# Altium project PCB_LDB-U01.PRJPCB (part 2 of 2)
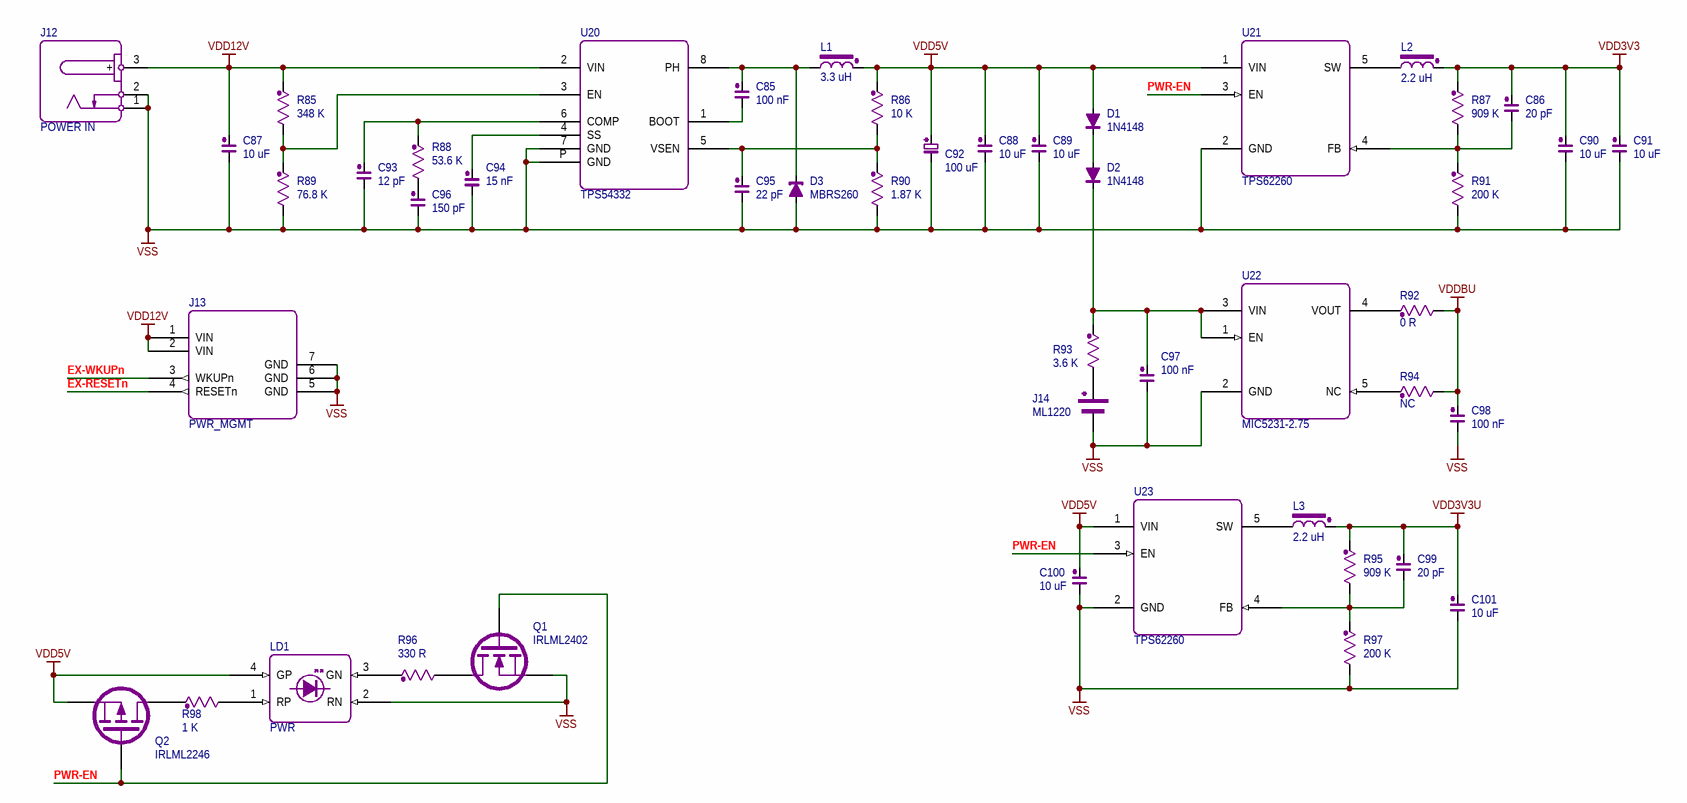
[diagram p9: 09_POWER.SchDoc]

## Nets that join several sheets
VDD3V3: 02_IO_PORTS (18 pins), 03_SHIELD_SLOT_A (8 pins), 04_SHIELD_SLOT_B (8 pins), 05_USB_PORTS (R31.2), 06_ETHERNET (20 pins), 08_JTAG_DEBUG (5 pins), 09_POWER (5 pins)
VDD3V3U: 05_USB_PORTS (13 pins), 08_JTAG_DEBUG (20 pins), 09_POWER (C99.2 C101.2 L3.2 R95.2)
VDD5V: 02_IO_PORTS (7 pins), 05_USB_PORTS (5 pins), 07_AC97_AUDIO (C65.2 U16.1), 08_JTAG_DEBUG (J1.1 J1.3 J1.5 J1.7), 09_POWER (11 pins)
VDD5V-LPA: 02_IO_PORTS (U1.5), 03_SHIELD_SLOT_A (C2.2 J4.35 J4.36)
VDD5V-LPB: 02_IO_PORTS (U1.8), 04_SHIELD_SLOT_B (C11.2 J5.35 J5.36)
VDDBU: 08_JTAG_DEBUG (J1.2 J1.4), 09_POWER (C98.2 R92.1 R94.1)
VSS: 01_Structure (6 pins), 02_IO_PORTS (26 pins), 03_SHIELD_SLOT_A (21 pins), 04_SHIELD_SLOT_B (21 pins), 05_USB_PORTS (30 pins), 06_ETHERNET (19 pins), 07_AC97_AUDIO (17 pins), 08_JTAG_DEBUG (69 pins), 09_POWER (32 pins)
AC97-MCLK: 02_IO_PORTS (J1.138), 07_AC97_AUDIO (R65.1 U15.2)
AC97-RSTn: 02_IO_PORTS (J1.25), 07_AC97_AUDIO (U15.11)
AC97-SCLK: 02_IO_PORTS (J1.131), 07_AC97_AUDIO (U15.6)
AC97-SDI: 02_IO_PORTS (J1.145), 07_AC97_AUDIO (U15.8)
AC97-SDO: 02_IO_PORTS (J1.129), 07_AC97_AUDIO (U15.5)
AC97-SFS: 02_IO_PORTS (J1.147), 07_AC97_AUDIO (U15.10)
EX-RESETn: 08_JTAG_DEBUG (J1.13 J11.3 R78.1 SW1.2), 09_POWER (J13.4)
EX-WKUPn: 08_JTAG_DEBUG (J1.11 SW2.2), 09_POWER (J13.3)
FT-URXD: 02_IO_PORTS (R4.2), 08_JTAG_DEBUG (U17.39)
FT-UTXD: 02_IO_PORTS (R1.2), 08_JTAG_DEBUG (U17.38)
IN-DET: 02_IO_PORTS (J1.197), 07_AC97_AUDIO (J10.5 R71.1)
IN-OPT: 02_IO_PORTS (J1.199), 07_AC97_AUDIO (J10.1 R70.1)
LOP-OE-AH: 02_IO_PORTS (J1.98), 03_SHIELD_SLOT_A (U4.10 U5.10)
LOP-OE-AL: 02_IO_PORTS (J1.99), 03_SHIELD_SLOT_A (U2.10 U3.10)
LOP-OE-BH: 02_IO_PORTS (J1.188), 04_SHIELD_SLOT_B (U8.10 U9.10)
LOP-OE-BL: 02_IO_PORTS (J1.177), 04_SHIELD_SLOT_B (U6.10 U7.10)
LOPA-I2CSCL: 02_IO_PORTS (J1.86), 03_SHIELD_SLOT_A (U5.9)
LOPA-I2CSDA: 02_IO_PORTS (J1.88), 03_SHIELD_SLOT_A (U5.8)
LOPA-IO0: 02_IO_PORTS (J1.91), 03_SHIELD_SLOT_A (U2.6)
LOPA-IO1: 02_IO_PORTS (J1.89), 03_SHIELD_SLOT_A (U2.5)
LOPA-IO2: 02_IO_PORTS (J1.87), 03_SHIELD_SLOT_A (U2.4)
LOPA-IO3: 02_IO_PORTS (J1.83), 03_SHIELD_SLOT_A (U2.1)
LOPA-IO4: 02_IO_PORTS (J1.85), 03_SHIELD_SLOT_A (U2.3)
LOPA-IO5: 02_IO_PORTS (J1.93), 03_SHIELD_SLOT_A (U2.7)
LOPA-IO6: 02_IO_PORTS (J1.95), 03_SHIELD_SLOT_A (U2.8)
LOPA-IO7: 02_IO_PORTS (J1.97), 03_SHIELD_SLOT_A (U2.9)
LOPA-IO8: 02_IO_PORTS (J1.103), 03_SHIELD_SLOT_A (U3.1)
LOPA-IO9: 02_IO_PORTS (J1.105), 03_SHIELD_SLOT_A (U3.3)
LOPA-IO10: 02_IO_PORTS (J1.107), 03_SHIELD_SLOT_A (U3.4)
LOPA-IO11: 02_IO_PORTS (J1.109), 03_SHIELD_SLOT_A (U3.5)
LOPA-IO12: 02_IO_PORTS (J1.111), 03_SHIELD_SLOT_A (U3.6)
LOPA-IO13: 02_IO_PORTS (J1.113), 03_SHIELD_SLOT_A (U3.7)
LOPA-IO14: 02_IO_PORTS (J1.114), 03_SHIELD_SLOT_A (U4.1)
LOPA-IO15: 02_IO_PORTS (J1.112), 03_SHIELD_SLOT_A (U4.3)
LOPA-IO16: 02_IO_PORTS (J1.110), 03_SHIELD_SLOT_A (U4.4)
LOPA-IO17: 02_IO_PORTS (J1.108), 03_SHIELD_SLOT_A (U4.5)
LOPA-IO18: 02_IO_PORTS (J1.106), 03_SHIELD_SLOT_A (U4.6)
LOPA-IO19: 02_IO_PORTS (J1.104), 03_SHIELD_SLOT_A (U4.7)
LOPA-IO20: 02_IO_PORTS (J1.102), 03_SHIELD_SLOT_A (U4.8)
LOPA-IO21: 02_IO_PORTS (J1.100), 03_SHIELD_SLOT_A (U4.9)
LOPA-IO22: 02_IO_PORTS (J1.96), 03_SHIELD_SLOT_A (U5.4)
LOPA-IO23: 02_IO_PORTS (J1.94), 03_SHIELD_SLOT_A (U5.5)
LOPA-IO24: 02_IO_PORTS (J1.92), 03_SHIELD_SLOT_A (U5.6)
LOPA-IO25: 02_IO_PORTS (J1.90), 03_SHIELD_SLOT_A (U5.7)
LOPB-I2CSCL: 02_IO_PORTS (J1.170), 04_SHIELD_SLOT_B (U9.7)
LOPB-I2CSDA: 02_IO_PORTS (J1.172), 04_SHIELD_SLOT_B (U9.6)
LOPB-IO0: 02_IO_PORTS (J1.163), 04_SHIELD_SLOT_B (U6.4)
LOPB-IO1: 02_IO_PORTS (J1.165), 04_SHIELD_SLOT_B (U6.5)
LOPB-IO2: 02_IO_PORTS (J1.167), 04_SHIELD_SLOT_B (U6.6)
LOPB-IO3: 02_IO_PORTS (J1.169), 04_SHIELD_SLOT_B (U6.7)
LOPB-IO4: 02_IO_PORTS (J1.171), 04_SHIELD_SLOT_B (U6.8)
LOPB-IO5: 02_IO_PORTS (J1.173), 04_SHIELD_SLOT_B (U6.9)
LOPB-IO6: 02_IO_PORTS (J1.179), 04_SHIELD_SLOT_B (U7.1)
LOPB-IO7: 02_IO_PORTS (J1.181), 04_SHIELD_SLOT_B (U7.3)
LOPB-IO8: 02_IO_PORTS (J1.183), 04_SHIELD_SLOT_B (U7.4)
LOPB-IO9: 02_IO_PORTS (J1.185), 04_SHIELD_SLOT_B (U7.5)
LOPB-IO10: 02_IO_PORTS (J1.187), 04_SHIELD_SLOT_B (U7.6)
LOPB-IO11: 02_IO_PORTS (J1.189), 04_SHIELD_SLOT_B (U7.7)
LOPB-IO12: 02_IO_PORTS (J1.191), 04_SHIELD_SLOT_B (U7.8)
LOPB-IO13: 02_IO_PORTS (J1.193), 04_SHIELD_SLOT_B (U7.9)
LOPB-IO14: 02_IO_PORTS (J1.194), 04_SHIELD_SLOT_B (U8.1)
LOPB-IO15: 02_IO_PORTS (J1.192), 04_SHIELD_SLOT_B (U8.3)
LOPB-IO16: 02_IO_PORTS (J1.190), 04_SHIELD_SLOT_B (U8.4)
LOPB-IO17: 02_IO_PORTS (J1.186), 04_SHIELD_SLOT_B (U8.5)
LOPB-IO18: 02_IO_PORTS (J1.184), 04_SHIELD_SLOT_B (U8.6)
LOPB-IO19: 02_IO_PORTS (J1.182), 04_SHIELD_SLOT_B (U8.7)
LOPB-IO20: 02_IO_PORTS (J1.166), 04_SHIELD_SLOT_B (U9.9)
LOPB-IO21: 02_IO_PORTS (J1.168), 04_SHIELD_SLOT_B (U9.8)
LOPB-IO22: 02_IO_PORTS (J1.180), 04_SHIELD_SLOT_B (U9.1)
LOPB-IO23: 02_IO_PORTS (J1.178), 04_SHIELD_SLOT_B (U9.3)
LOPB-IO24: 02_IO_PORTS (J1.176), 04_SHIELD_SLOT_B (U9.4)
LOPB-IO25: 02_IO_PORTS (J1.174), 04_SHIELD_SLOT_B (U9.5)
OUT-DET: 02_IO_PORTS (J1.164), 07_AC97_AUDIO (J9.5 R61.1)
OUT-OPT: 02_IO_PORTS (J1.175), 07_AC97_AUDIO (J9.1 R60.1)
PWR-EN: 02_IO_PORTS (J3.45), 07_AC97_AUDIO (U16.3), 08_JTAG_DEBUG (J1.8 R83.2), 09_POWER (Q1.1 Q2.1 U21.3 U23.3)
RMII0-CRSDV: 02_IO_PORTS (J1.52), 06_ETHERNET (R45.1 U14.37)
RMII0-MDCK: 02_IO_PORTS (J1.54), 06_ETHERNET (U14.24)
RMII0-MDINT: 02_IO_PORTS (J1.58), 06_ETHERNET (R54.1 U14.32)
RMII0-MDIO: 02_IO_PORTS (J1.56), 06_ETHERNET (R53.1 U14.25)
RMII0-REFCLK: 02_IO_PORTS (J1.24), 06_ETHERNET (R39.1 U14.42)
RMII0-RPTR: 02_IO_PORTS (J1.50), 06_ETHERNET (R46.1 U14.38)
RMII0-RX0: 02_IO_PORTS (J1.46), 06_ETHERNET (R50.1 U14.29)
RMII0-RX1: 02_IO_PORTS (J1.44), 06_ETHERNET (R49.1 U14.28)
RMII0-TX0: 02_IO_PORTS (J1.34), 06_ETHERNET (U14.20)
RMII0-TX1: 02_IO_PORTS (J1.32), 06_ETHERNET (U14.19)
RMII0-TXEN: 02_IO_PORTS (J1.36), 06_ETHERNET (U14.21)
SPDIF-IN: 02_IO_PORTS (J1.137), 07_AC97_AUDIO (J10.6)
SPDIF-OUT: 02_IO_PORTS (J1.135), 07_AC97_AUDIO (J9.8)
SYS-RESETn: 02_IO_PORTS (J3.37), 06_ETHERNET (U14.40), 08_JTAG_DEBUG (J1.15)
UDBG-DM: 05_USB_PORTS (U10.28), 08_JTAG_DEBUG (U17.7)
UDBG-DP: 05_USB_PORTS (U10.1), 08_JTAG_DEBUG (U17.8)
UDBG-VBUS: 05_USB_PORTS (U10.7), 08_JTAG_DEBUG (R76.2 U17.59)
UOTG-DM: 02_IO_PORTS (J1.14), 05_USB_PORTS (U10.2)
UOTG-DP: 02_IO_PORTS (J1.12), 05_USB_PORTS (U10.3)
UOTG-VBUS: 02_IO_PORTS (J1.23), 05_USB_PORTS (R24.2 R27.2)
USBH-DM: 02_IO_PORTS (J1.20), 05_USB_PORTS (J7.2 U12.4)
USBH-DP: 02_IO_PORTS (J1.18), 05_USB_PORTS (J7.3 U12.6)
USBH-OCn: 02_IO_PORTS (J1.21), 05_USB_PORTS (R31.1 U13.3)
USBH-PWREN: 02_IO_PORTS (J1.19), 05_USB_PORTS (R32.1 U13.4)